# Altium schematic sheet Valvulas.SchDoc
size A4
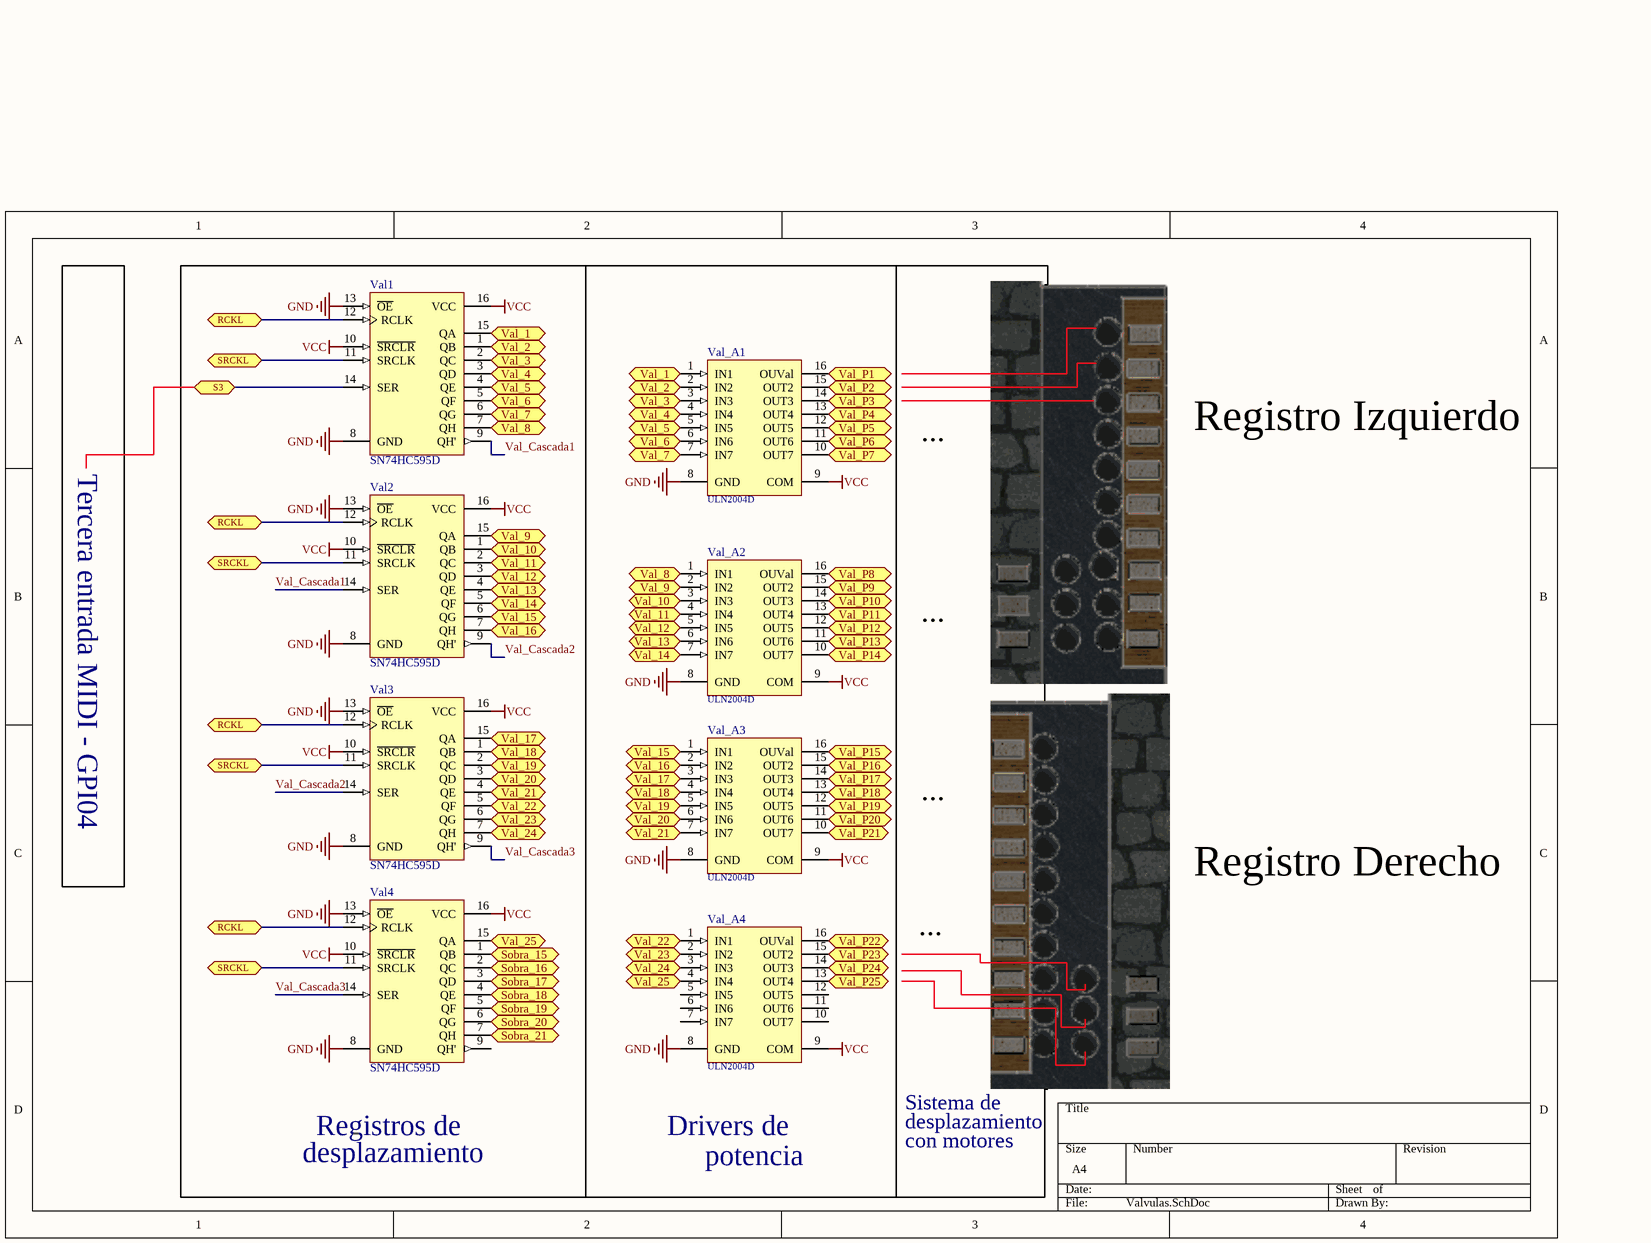
[diagram p0: Valvulas.SchDoc]

## Parts
Val1  SN74HC595D  [D016_N]
Val2  SN74HC595D  [D016_N]
Val3  SN74HC595D  [D016_N]
Val4  SN74HC595D  [D016_N]
Val_A1  ULN2004D  [SO16_N]
Val_A2  ULN2004D  [SO16_N]
Val_A3  ULN2004D  [SO16_N]
Val_A4  ULN2004D  [SO16_N]

## Ports
RCKL, S3, Sobra_15, Sobra_16, Sobra_17, Sobra_18, Sobra_19, Sobra_20, Sobra_21, SRCKL, Val_1, Val_2, Val_3, Val_4, Val_5, Val_6, Val_7, Val_8, Val_9, Val_10, Val_11, Val_12, Val_13, Val_14, Val_15, Val_16, Val_17, Val_18, Val_19, Val_20, Val_21, Val_22, Val_23, Val_24, Val_25, Val_P1, Val_P2, Val_P3, Val_P4, Val_P5, Val_P6, Val_P7, Val_P8, Val_P9, Val_P10, Val_P11, Val_P12, Val_P13, Val_P14, Val_P15, Val_P16, Val_P17, Val_P18, Val_P19, Val_P20, Val_P21, Val_P22, Val_P23, Val_P24, Val_P25

## Nets
GND: Val1.8(GND) Val1.13(~{OE}) Val2.8(GND) Val2.13(~{OE}) Val3.8(GND) Val3.13(~{OE}) Val4.8(GND) Val4.13(~{OE}) Val_A1.8(GND) Val_A2.8(GND) Val_A3.8(GND) Val_A4.8(GND)
VCC: Val1.10(~{SRCLR}) Val1.16(VCC) Val2.10(~{SRCLR}) Val2.16(VCC) Val3.10(~{SRCLR}) Val3.16(VCC) Val4.10(~{SRCLR}) Val4.16(VCC) Val_A1.9(COM) Val_A2.9(COM) Val_A3.9(COM) Val_A4.9(COM)
RCKL: Val1.12(RCLK) Val2.12(RCLK) Val3.12(RCLK) Val4.12(RCLK) ; port RCKL
S3: Val1.14(SER) ; port S3
Sobra_15: Val4.1(QB) ; port Sobra_15
Sobra_16: Val4.2(QC) ; port Sobra_16
Sobra_17: Val4.3(QD) ; port Sobra_17
Sobra_18: Val4.4(QE) ; port Sobra_18
Sobra_19: Val4.5(QF) ; port Sobra_19
Sobra_20: Val4.6(QG) ; port Sobra_20
Sobra_21: Val4.7(QH) ; port Sobra_21
SRCKL: Val1.11(SRCLK) Val2.11(SRCLK) Val3.11(SRCLK) Val4.11(SRCLK) ; port SRCKL
Val_1: Val1.15(QA) Val_A1.1(IN1) ; port Val_1
Val_2: Val1.1(QB) Val_A1.2(IN2) ; port Val_2
Val_3: Val1.2(QC) Val_A1.3(IN3) ; port Val_3
Val_4: Val1.3(QD) Val_A1.4(IN4) ; port Val_4
Val_5: Val1.4(QE) Val_A1.5(IN5) ; port Val_5
Val_6: Val1.5(QF) Val_A1.6(IN6) ; port Val_6
Val_7: Val1.6(QG) Val_A1.7(IN7) ; port Val_7
Val_8: Val1.7(QH) Val_A2.1(IN1) ; port Val_8
Val_9: Val2.15(QA) Val_A2.2(IN2) ; port Val_9
Val_10: Val2.1(QB) Val_A2.3(IN3) ; port Val_10
Val_11: Val2.2(QC) Val_A2.4(IN4) ; port Val_11
Val_12: Val2.3(QD) Val_A2.5(IN5) ; port Val_12
Val_13: Val2.4(QE) Val_A2.6(IN6) ; port Val_13
Val_14: Val2.5(QF) Val_A2.7(IN7) ; port Val_14
Val_15: Val2.6(QG) Val_A3.1(IN1) ; port Val_15
Val_16: Val2.7(QH) Val_A3.2(IN2) ; port Val_16
Val_17: Val3.15(QA) Val_A3.3(IN3) ; port Val_17
Val_18: Val3.1(QB) Val_A3.4(IN4) ; port Val_18
Val_19: Val3.2(QC) Val_A3.5(IN5) ; port Val_19
Val_20: Val3.3(QD) Val_A3.6(IN6) ; port Val_20
Val_21: Val3.4(QE) Val_A3.7(IN7) ; port Val_21
Val_22: Val3.5(QF) Val_A4.1(IN1) ; port Val_22
Val_23: Val3.6(QG) Val_A4.2(IN2) ; port Val_23
Val_24: Val3.7(QH) Val_A4.3(IN3) ; port Val_24
Val_25: Val4.15(QA) Val_A4.4(IN4) ; port Val_25
Val_Cascada1: Val1.9(QH') Val2.14(SER)
Val_Cascada2: Val2.9(QH') Val3.14(SER)
Val_Cascada3: Val3.9(QH') Val4.14(SER)
Val_P1: Val_A1.16(OUVal) ; port Val_P1
Val_P2: Val_A1.15(OUT2) ; port Val_P2
Val_P3: Val_A1.14(OUT3) ; port Val_P3
Val_P4: Val_A1.13(OUT4) ; port Val_P4
Val_P5: Val_A1.12(OUT5) ; port Val_P5
Val_P6: Val_A1.11(OUT6) ; port Val_P6
Val_P7: Val_A1.10(OUT7) ; port Val_P7
Val_P8: Val_A2.16(OUVal) ; port Val_P8
Val_P9: Val_A2.15(OUT2) ; port Val_P9
Val_P10: Val_A2.14(OUT3) ; port Val_P10
Val_P11: Val_A2.13(OUT4) ; port Val_P11
Val_P12: Val_A2.12(OUT5) ; port Val_P12
Val_P13: Val_A2.11(OUT6) ; port Val_P13
Val_P14: Val_A2.10(OUT7) ; port Val_P14
Val_P15: Val_A3.16(OUVal) ; port Val_P15
Val_P16: Val_A3.15(OUT2) ; port Val_P16
Val_P17: Val_A3.14(OUT3) ; port Val_P17
Val_P18: Val_A3.13(OUT4) ; port Val_P18
Val_P19: Val_A3.12(OUT5) ; port Val_P19
Val_P20: Val_A3.11(OUT6) ; port Val_P20
Val_P21: Val_A3.10(OUT7) ; port Val_P21
Val_P22: Val_A4.16(OUVal) ; port Val_P22
Val_P23: Val_A4.15(OUT2) ; port Val_P23
Val_P24: Val_A4.14(OUT3) ; port Val_P24
Val_P25: Val_A4.13(OUT4) ; port Val_P25

Not connected (* = marked no-connect by the designer): Val4 9(QH'); Val_A4 5(IN5) 6(IN6) 7(IN7) 10(OUT7) 11(OUT6) 12(OUT5)

## Notes on the sheet
- ...
- Registro Izquierdo
- Tercera entrada MIDI - GPI04
- Registro Derecho
- Sistema de
- desplazamiento
- Registros de
- Drivers de
- potencia
- con motores

## Library data of the parts
Val1-Val4 = SN74HC595D: 8-Bit Shift Register with 3-State Output Registers; Published: 8-Jun-2000; LatestRevisionDate: 13-Apr-2006; LatestRevisionNote: IPC-7351 Footprint Added.; DatasheetVersion: May-1997; PackageVersion: Jan-1998; PackageReference: D016; Publisher: Altium Limited; PackageDescription: 16-Pin Small Outline Integrated Circuit 1.27 mm Pitch; Code_IPC: SOIC127P600-16; ComponentLink1Description: Manufacturer Link; ComponentLink1URL: http://www.ti.com/; ComponentLink2Description: Datasheet; ComponentLink2URL: http://www-s.ti.com/sc/ds/sn74hc595.pdf
Val_A1-Val_A4 = ULN2004D: Seven Darlington Array; Published: 8-Jun-2000; LatestRevisionDate: 13-Apr-2006; LatestRevisionNote: IPC-7351 Footprint Added.; DatasheetVersion: Sep-1998; PackageVersion: May-1998; PackageReference: SO16; Publisher: Altium Limited; PackageDescription: 16-Pin Small Outline Integrated Circuit 1.27 mm Pitch; Code_IPC: SOIC127P600-16; ComponentLink1Description: Manufacturer Link; ComponentLink1URL: http://www.st.com/; ComponentLink2Description: Datasheet; ComponentLink2URL: http://www.st.com/stonline/products/literature/ds/5279/uln2001.pdf